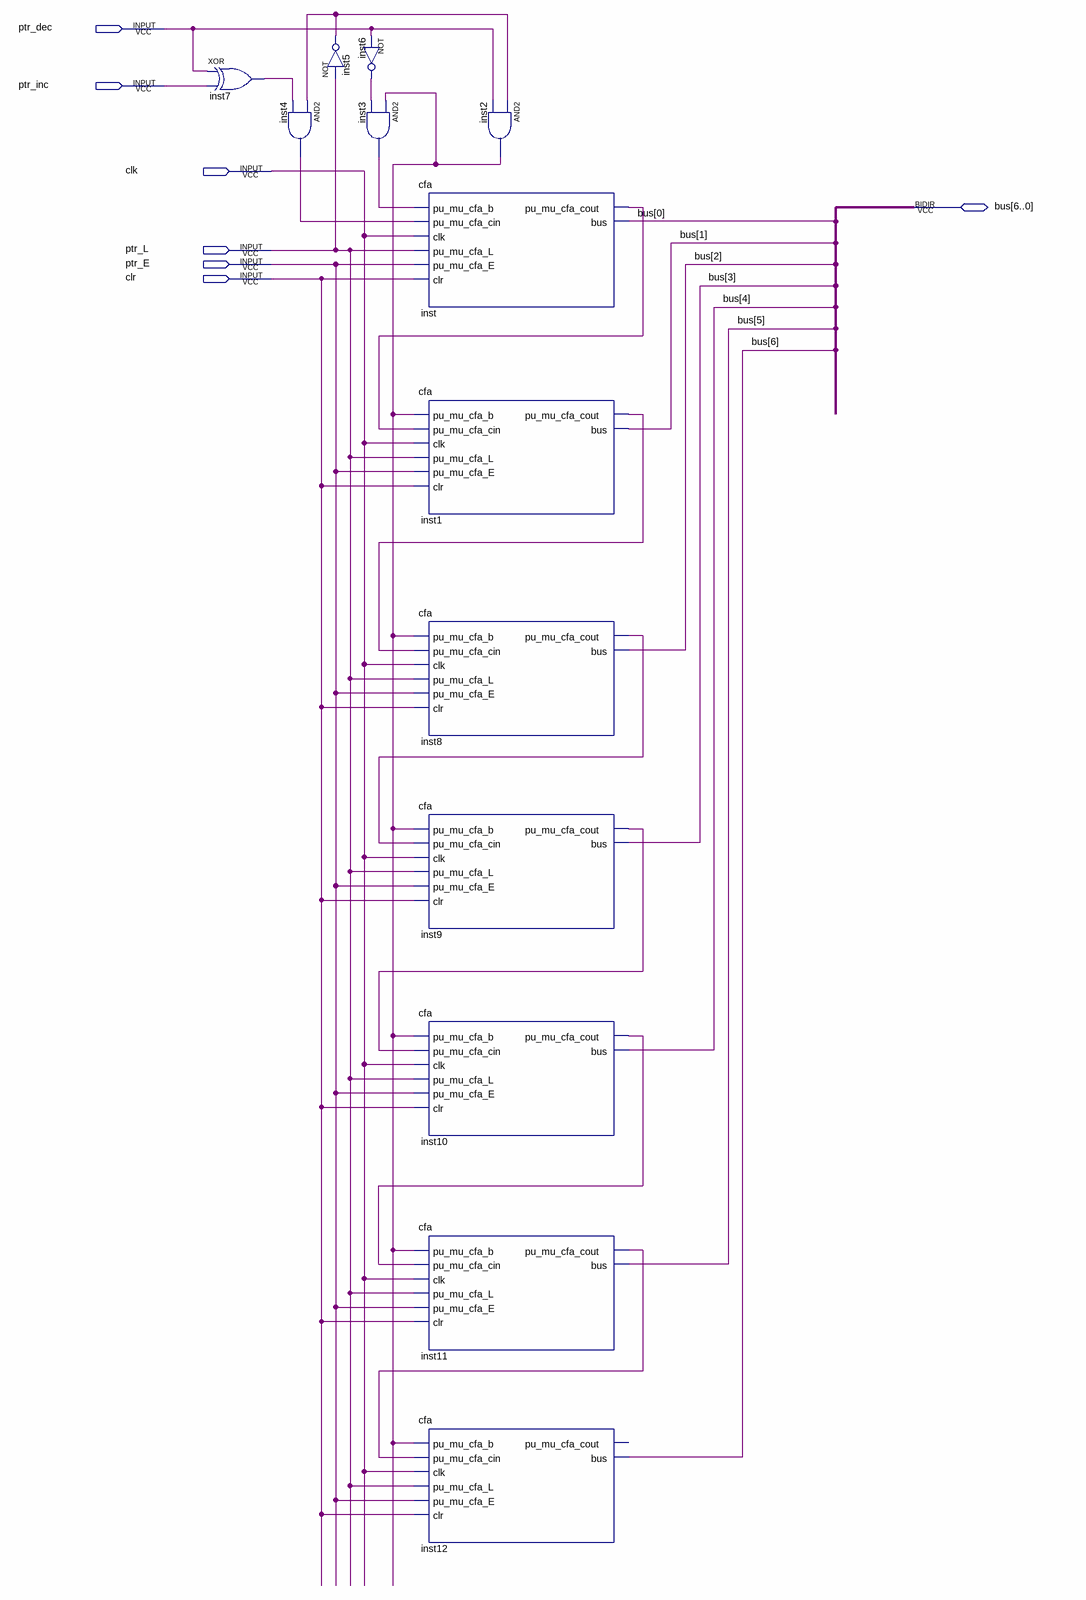
[diagram p0: schematic sheet]
// Quartus schematic ptrio.bdf as structural Verilog: 13 symbols, 7 pins
module ptrio (
  input  ptr_dec,
  input  ptr_inc,
  input  clk,
  input  ptr_L,
  input  ptr_E,
  input  clr,
  inout  [6:0] bus
);

  wire inst1_pu_mu_cfa_cout, inst2_out, inst3_out, inst4_out, inst5_out, inst6_out, inst7_out,
       inst8_pu_mu_cfa_cout, inst9_pu_mu_cfa_cout, inst10_pu_mu_cfa_cout, inst11_pu_mu_cfa_cout,
       inst_pu_mu_cfa_cout;

  xor inst7 (inst7_out, ptr_dec, ptr_inc);
  not inst5 (inst5_out, ptr_L);
  and inst4 (inst4_out, inst5_out, inst7_out);
  not inst6 (inst6_out, ptr_dec);
  and inst3 (inst3_out, inst2_out, inst6_out);
  cfa inst (
    .pu_mu_cfa_b(inst3_out), .pu_mu_cfa_cin(inst4_out), .clk(clk), .pu_mu_cfa_L(ptr_L), .pu_mu_cfa_E(ptr_E),
    .clr(clr), .pu_mu_cfa_cout(inst_pu_mu_cfa_cout), .bus(bus[0]));
  cfa inst1 (
    .pu_mu_cfa_b(inst2_out), .pu_mu_cfa_cin(inst_pu_mu_cfa_cout), .clk(clk), .pu_mu_cfa_L(ptr_L),
    .pu_mu_cfa_E(ptr_E), .clr(clr), .pu_mu_cfa_cout(inst1_pu_mu_cfa_cout), .bus(bus[1]));
  cfa inst8 (
    .pu_mu_cfa_b(inst2_out), .pu_mu_cfa_cin(inst1_pu_mu_cfa_cout), .clk(clk), .pu_mu_cfa_L(ptr_L),
    .pu_mu_cfa_E(ptr_E), .clr(clr), .pu_mu_cfa_cout(inst8_pu_mu_cfa_cout), .bus(bus[2]));
  cfa inst9 (
    .pu_mu_cfa_b(inst2_out), .pu_mu_cfa_cin(inst8_pu_mu_cfa_cout), .clk(clk), .pu_mu_cfa_L(ptr_L),
    .pu_mu_cfa_E(ptr_E), .clr(clr), .pu_mu_cfa_cout(inst9_pu_mu_cfa_cout), .bus(bus[3]));
  cfa inst10 (
    .pu_mu_cfa_b(inst2_out), .pu_mu_cfa_cin(inst9_pu_mu_cfa_cout), .clk(clk), .pu_mu_cfa_L(ptr_L),
    .pu_mu_cfa_E(ptr_E), .clr(clr), .pu_mu_cfa_cout(inst10_pu_mu_cfa_cout), .bus(bus[4]));
  cfa inst11 (
    .pu_mu_cfa_b(inst2_out), .pu_mu_cfa_cin(inst10_pu_mu_cfa_cout), .clk(clk), .pu_mu_cfa_L(ptr_L),
    .pu_mu_cfa_E(ptr_E), .clr(clr), .pu_mu_cfa_cout(inst11_pu_mu_cfa_cout), .bus(bus[5]));
  cfa inst12 (
    .pu_mu_cfa_b(inst2_out), .pu_mu_cfa_cin(inst11_pu_mu_cfa_cout), .clk(clk), .pu_mu_cfa_L(ptr_L),
    .pu_mu_cfa_E(ptr_E), .clr(clr), .bus(bus[6]));  // open: pu_mu_cfa_cout
  and inst2 (inst2_out, inst5_out, ptr_dec);
endmodule
